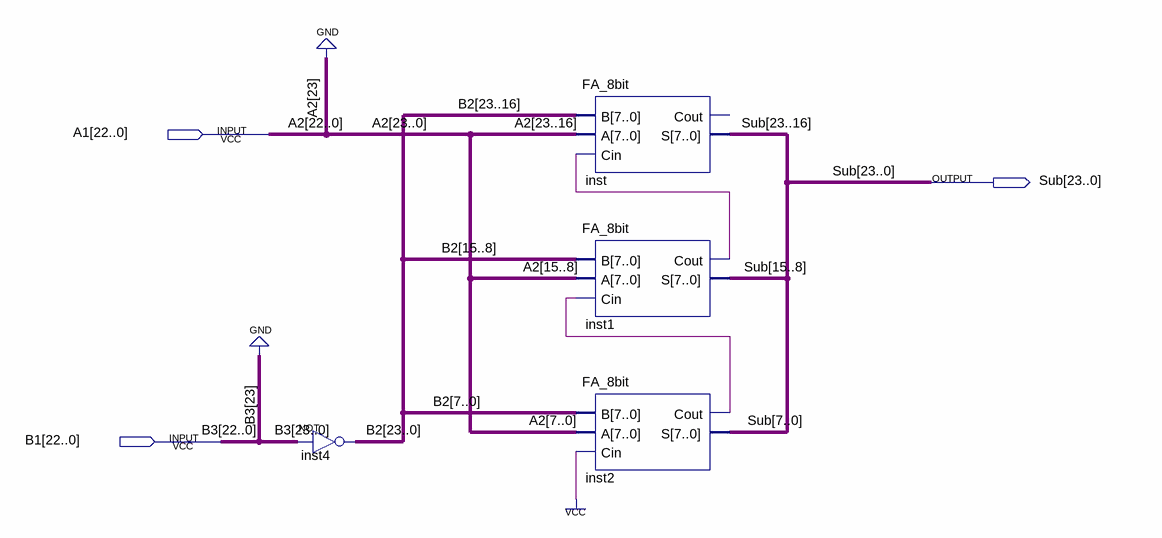
[diagram p0: schematic sheet]
// Quartus schematic Sub_24bit.bdf as structural Verilog: 4 symbols, 3 pins
module Sub_24bit (
  input  [22:0] A1,
  input  [22:0] B1,
  output [23:0] Sub
);

  wire inst1_cout, inst2_cout;
  wire [23:0] B2;

  assign B2 = ~{1'b0, B1};  // NOT inst4, 24 bits wide
  FA_8bit inst (.B(B2[23:16]), .A({1'b0, A1[22:16]}), .Cin(inst1_cout), .S(Sub[23:16]));  // open: Cout
  FA_8bit inst1 (.B(B2[15:8]), .A(A1[15:8]), .Cin(inst2_cout), .Cout(inst1_cout), .S(Sub[15:8]));
  FA_8bit inst2 (.B(B2[7:0]), .A(A1[7:0]), .Cin(1'b1), .Cout(inst2_cout), .S(Sub[7:0]));

  // Other names for the same wires on the sheet: A2[22:0] = A1; B3[22:0] = B1
endmodule
